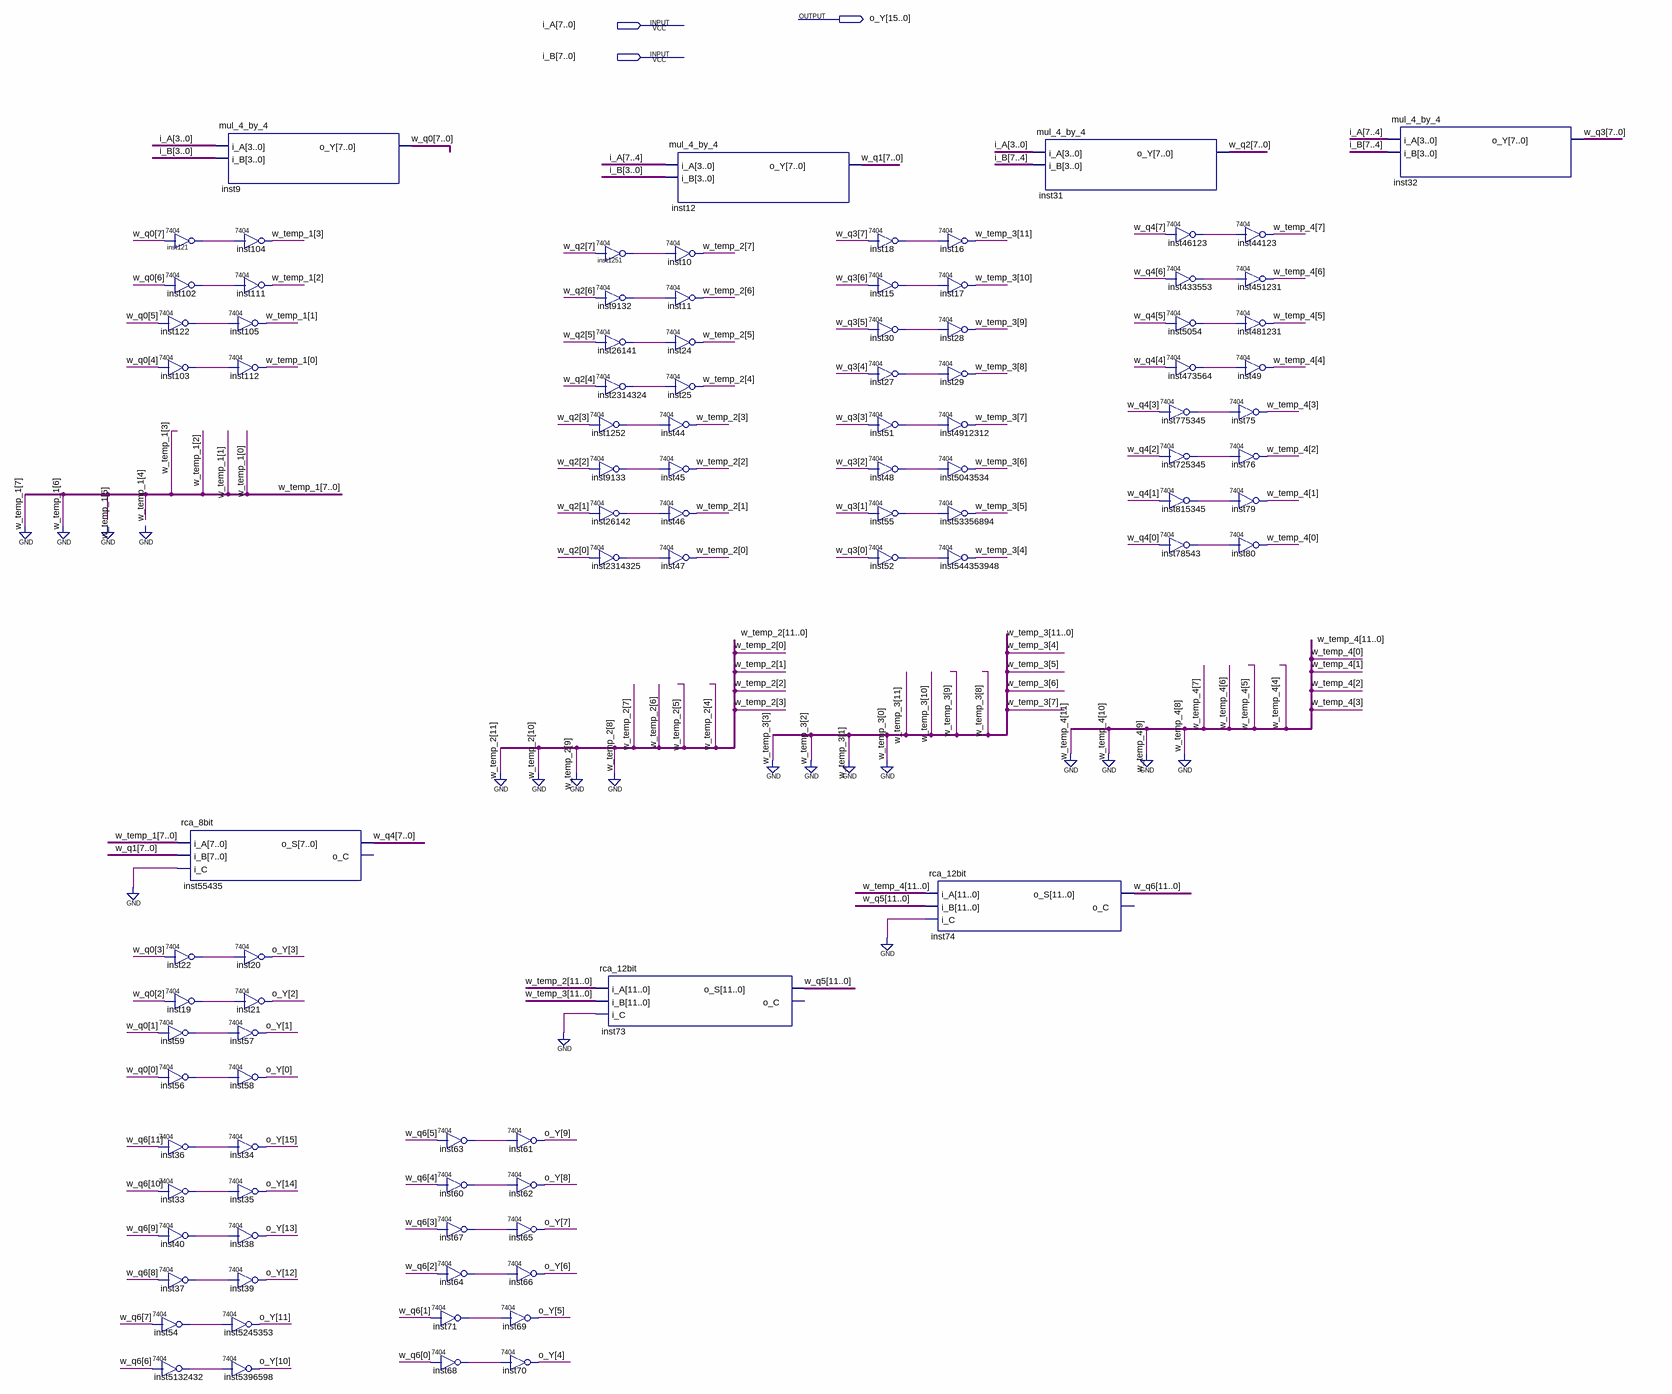
[diagram p0: schematic sheet]
// Quartus schematic mul_8_by_8.bdf as structural Verilog: 95 symbols, 3 pins
module mul_8_by_8 (
  input  [7:0] i_A,
  input  [7:0] i_B,
  output [15:0] o_Y
);

  wire inst15_1, inst18_1, inst19_1, inst22_1, inst27_1, inst30_1, inst33_1, inst36_1, inst37_1, inst40_1,
       inst48_1, inst51_1, inst52_1, inst54_1, inst55_1, inst56_1, inst59_1, inst60_1, inst63_1, inst64_1,
       inst67_1, inst68_1, inst71_1, inst102_1, inst103_1, inst121_1, inst122_1, inst1251_1, inst1252_1,
       inst5054_1, inst9132_1, inst9133_1, inst26141_1, inst26142_1, inst46123_1, inst78543_1, inst433553_1,
       inst473564_1, inst725345_1, inst775345_1, inst815345_1, inst2314324_1, inst2314325_1, inst5132432_1;
  wire [5:0] w_temp_1;
  wire [7:0] w_q0, w_q1, w_q2, w_q3, w_q4, w_temp_2, w_temp_4;
  wire [11:0] w_q5, w_q6;
  wire [11:4] w_temp_3;

  \7404  inst121 (.\2 (w_q0[7]), .\1 (inst121_1));
  \7404  inst102 (.\2 (w_q0[6]), .\1 (inst102_1));
  \7404  inst122 (.\2 (w_q0[5]), .\1 (inst122_1));
  \7404  inst103 (.\2 (w_q0[4]), .\1 (inst103_1));
  rca_8bit inst55435 (.i_A({2'b00, w_temp_1}), .i_B(w_q1), .i_C(1'b0), .o_S(w_q4));  // open: o_C
  \7404  inst22 (.\2 (w_q0[3]), .\1 (inst22_1));
  \7404  inst19 (.\2 (w_q0[2]), .\1 (inst19_1));
  \7404  inst59 (.\2 (w_q0[1]), .\1 (inst59_1));
  \7404  inst56 (.\2 (w_q0[0]), .\1 (inst56_1));
  \7404  inst36 (.\2 (w_q6[11]), .\1 (inst36_1));
  \7404  inst33 (.\2 (w_q6[10]), .\1 (inst33_1));
  \7404  inst40 (.\2 (w_q6[9]), .\1 (inst40_1));
  \7404  inst37 (.\2 (w_q6[8]), .\1 (inst37_1));
  \7404  inst54 (.\2 (w_q6[7]), .\1 (inst54_1));
  \7404  inst5132432 (.\2 (w_q6[6]), .\1 (inst5132432_1));
  mul_4_by_4 inst9 (.i_A(i_A[3:0]), .i_B(i_B[3:0]), .o_Y(w_q0));
  \7404  inst104 (.\2 (inst121_1), .\1 (w_temp_1[3]));
  \7404  inst111 (.\2 (inst102_1), .\1 (w_temp_1[2]));
  \7404  inst105 (.\2 (inst122_1), .\1 (w_temp_1[1]));
  \7404  inst112 (.\2 (inst103_1), .\1 (w_temp_1[0]));
  \7404  inst20 (.\2 (inst22_1), .\1 (o_Y[3]));
  \7404  inst21 (.\2 (inst19_1), .\1 (o_Y[2]));
  \7404  inst57 (.\2 (inst59_1), .\1 (o_Y[1]));
  \7404  inst58 (.\2 (inst56_1), .\1 (o_Y[0]));
  \7404  inst34 (.\2 (inst36_1), .\1 (o_Y[15]));
  \7404  inst35 (.\2 (inst33_1), .\1 (o_Y[14]));
  \7404  inst38 (.\2 (inst40_1), .\1 (o_Y[13]));
  \7404  inst39 (.\2 (inst37_1), .\1 (o_Y[12]));
  \7404  inst5245353 (.\2 (inst54_1), .\1 (o_Y[11]));
  \7404  inst5396598 (.\2 (inst5132432_1), .\1 (o_Y[10]));
  \7404  inst63 (.\2 (w_q6[5]), .\1 (inst63_1));
  \7404  inst60 (.\2 (w_q6[4]), .\1 (inst60_1));
  \7404  inst67 (.\2 (w_q6[3]), .\1 (inst67_1));
  \7404  inst64 (.\2 (w_q6[2]), .\1 (inst64_1));
  \7404  inst71 (.\2 (w_q6[1]), .\1 (inst71_1));
  \7404  inst68 (.\2 (w_q6[0]), .\1 (inst68_1));
  \7404  inst61 (.\2 (inst63_1), .\1 (o_Y[9]));
  \7404  inst62 (.\2 (inst60_1), .\1 (o_Y[8]));
  \7404  inst65 (.\2 (inst67_1), .\1 (o_Y[7]));
  \7404  inst66 (.\2 (inst64_1), .\1 (o_Y[6]));
  \7404  inst69 (.\2 (inst71_1), .\1 (o_Y[5]));
  \7404  inst70 (.\2 (inst68_1), .\1 (o_Y[4]));
  \7404  inst1251 (.\2 (w_q2[7]), .\1 (inst1251_1));
  \7404  inst9132 (.\2 (w_q2[6]), .\1 (inst9132_1));
  \7404  inst26141 (.\2 (w_q2[5]), .\1 (inst26141_1));
  \7404  inst2314324 (.\2 (w_q2[4]), .\1 (inst2314324_1));
  \7404  inst1252 (.\2 (w_q2[3]), .\1 (inst1252_1));
  \7404  inst9133 (.\2 (w_q2[2]), .\1 (inst9133_1));
  \7404  inst26142 (.\2 (w_q2[1]), .\1 (inst26142_1));
  \7404  inst2314325 (.\2 (w_q2[0]), .\1 (inst2314325_1));
  rca_12bit inst73 (.i_A({4'b0000, w_temp_2}), .i_B({w_temp_3, 4'b0000}), .i_C(1'b0), .o_S(w_q5));  // open: o_C
  mul_4_by_4 inst12 (.i_A(i_A[7:4]), .i_B(i_B[3:0]), .o_Y(w_q1));
  \7404  inst10 (.\2 (inst1251_1), .\1 (w_temp_2[7]));
  \7404  inst11 (.\2 (inst9132_1), .\1 (w_temp_2[6]));
  \7404  inst24 (.\2 (inst26141_1), .\1 (w_temp_2[5]));
  \7404  inst25 (.\2 (inst2314324_1), .\1 (w_temp_2[4]));
  \7404  inst44 (.\2 (inst1252_1), .\1 (w_temp_2[3]));
  \7404  inst45 (.\2 (inst9133_1), .\1 (w_temp_2[2]));
  \7404  inst46 (.\2 (inst26142_1), .\1 (w_temp_2[1]));
  \7404  inst47 (.\2 (inst2314325_1), .\1 (w_temp_2[0]));
  \7404  inst18 (.\2 (w_q3[7]), .\1 (inst18_1));
  \7404  inst15 (.\2 (w_q3[6]), .\1 (inst15_1));
  \7404  inst30 (.\2 (w_q3[5]), .\1 (inst30_1));
  \7404  inst27 (.\2 (w_q3[4]), .\1 (inst27_1));
  \7404  inst51 (.\2 (w_q3[3]), .\1 (inst51_1));
  \7404  inst48 (.\2 (w_q3[2]), .\1 (inst48_1));
  \7404  inst55 (.\2 (w_q3[1]), .\1 (inst55_1));
  \7404  inst52 (.\2 (w_q3[0]), .\1 (inst52_1));
  \7404  inst16 (.\2 (inst18_1), .\1 (w_temp_3[11]));
  \7404  inst17 (.\2 (inst15_1), .\1 (w_temp_3[10]));
  \7404  inst28 (.\2 (inst30_1), .\1 (w_temp_3[9]));
  \7404  inst29 (.\2 (inst27_1), .\1 (w_temp_3[8]));
  \7404  inst4912312 (.\2 (inst51_1), .\1 (w_temp_3[7]));
  \7404  inst5043534 (.\2 (inst48_1), .\1 (w_temp_3[6]));
  \7404  inst53356894 (.\2 (inst55_1), .\1 (w_temp_3[5]));
  \7404  inst544353948 (.\2 (inst52_1), .\1 (w_temp_3[4]));
  rca_12bit inst74 (.i_A({4'b0000, w_temp_4}), .i_B(w_q5), .i_C(1'b0), .o_S(w_q6));  // open: o_C
  mul_4_by_4 inst31 (.i_A(i_A[3:0]), .i_B(i_B[7:4]), .o_Y(w_q2));
  \7404  inst46123 (.\2 (w_q4[7]), .\1 (inst46123_1));
  \7404  inst433553 (.\2 (w_q4[6]), .\1 (inst433553_1));
  \7404  inst5054 (.\2 (w_q4[5]), .\1 (inst5054_1));
  \7404  inst473564 (.\2 (w_q4[4]), .\1 (inst473564_1));
  \7404  inst775345 (.\2 (w_q4[3]), .\1 (inst775345_1));
  \7404  inst725345 (.\2 (w_q4[2]), .\1 (inst725345_1));
  \7404  inst815345 (.\2 (w_q4[1]), .\1 (inst815345_1));
  \7404  inst78543 (.\2 (w_q4[0]), .\1 (inst78543_1));
  \7404  inst44123 (.\2 (inst46123_1), .\1 (w_temp_4[7]));
  \7404  inst451231 (.\2 (inst433553_1), .\1 (w_temp_4[6]));
  \7404  inst481231 (.\2 (inst5054_1), .\1 (w_temp_4[5]));
  \7404  inst49 (.\2 (inst473564_1), .\1 (w_temp_4[4]));
  \7404  inst75 (.\2 (inst775345_1), .\1 (w_temp_4[3]));
  \7404  inst76 (.\2 (inst725345_1), .\1 (w_temp_4[2]));
  \7404  inst79 (.\2 (inst815345_1), .\1 (w_temp_4[1]));
  \7404  inst80 (.\2 (inst78543_1), .\1 (w_temp_4[0]));
  mul_4_by_4 inst32 (.i_A(i_A[7:4]), .i_B(i_B[7:4]), .o_Y(w_q3));
endmodule
